# Altium schematic sheet BDK_cam_tay.SchDoc: Bo_dieu_khien_cam_tay
size A4 portrait
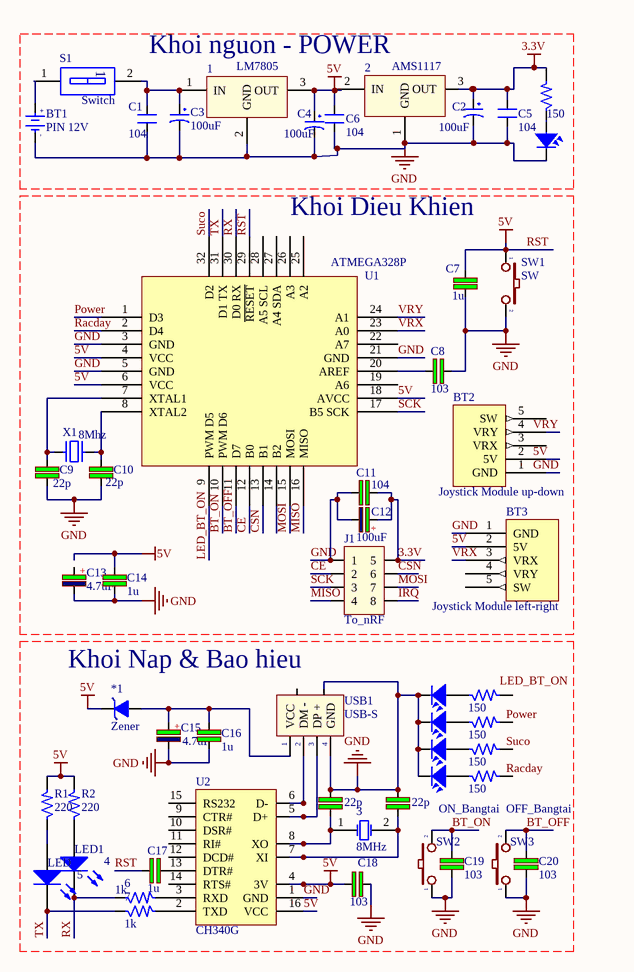
[diagram p0: BDK_cam_tay.SchDoc]

## Parts
(Parts that share a designator on the sheet are numbered #1, #2 ... from top to bottom, then left to right.)
1  LM7805  [QTO-220]
2  AMS1117  [QTO-220]
3  8MHz  [R38]
4  LED1  [3.5X2.8X1.9]
5  LED  [3.5X2.8X1.9]
6  1k  [SM-1206]
7  1k  [SM-1206]
*1  Zener  [D1A]
?#1  150  [SM-RES-1206]
?#2  LED SMD  [SM-LED-0805-Blue]  (value not drawn)
?#3  LED  [LED-3MM-YELLOW]  (value not drawn)
?#4  150  [SM-1206]
?#5  LED  [LED-3MM-YELLOW]  (value not drawn)
?#6  150  [SM-1206]
?#7  LED  [LED-3MM-YELLOW]  (value not drawn)
?#8  150  [SM-1206]
?#9  LED  [LED-3MM-YELLOW]  (value not drawn)
?#10  150  [SM-1206]
?#11  22p  [CN3]
?#12  22p  [CN3]
BT1  PIN 12V  [PIN3V]
BT2  Joystick Module up-down  [Joystick Module - duplicate2]
BT3  Joystick Module left-right  [Joystick Module - duplicate2]
C1  104  [CN2]
C2  100uF  [CP1.5/3.4]
C3  100uF  [CP1.5/3.4]
C4  100uF  [CP1.5/3.4]
C5  104  [CN2]
C6  104  [CN2]
C7  1u  [CN1.5]
C8  103  [C-0805]
C9  22p  [C-0805]
C10  22p  [C-0805]
C11  104  [CN1.5]
C12  100uF  [10uF/10V]
C13  4.7uF  [10uF/10V]
C14  1u  [CN1.5]
C15  4.7uF  [CP4.5/19]
C16  1u  [CN3]
C17  1u  [CN3]
C18  103  [CN3]
C19  103  [CN3]
C20  103  [CN3]
J1  To_nRF  [JP4x2]
R1  220  [SM-1206]
R2  220  [SM-1206]
S1  Switch  [DIP-4]
SW1  SW  [BUTTON 2PIN TRON]
SW2  ON_Bangtai  [SW1-SMD]
SW3  OFF_Bangtai  [SW1-SMD]
U1  ATMEGA328P  [TQFP80P900X900X120-32N]
U2  CH340G  [SO16]
USB1  USB-S  [USB-S1]
X1  8Mhz  [XT2]

## Nets
3.3V: 2.3(OUT) ?#1.2 C2.1 C5.2 C11.1 C12.1 J1.5
5V: 1.3(OUT) 2.2(IN) *1.2(K) BT3.2(5V) C4.1 C6.2 C7.2 C14.2 C17.2 C18.1 R1.2 R2.2 SW1.1 U1.4(VCC) U1.6(VCC) U1.18(AVCC) U1.29(~{RESET}) U2.4(3V) U2.16(VCC)  [also labelled RST]
GND: 1.2(GND) 2.1(GND) ?#2.2 ?#3.2 ?#5.2 ?#7.2 ?#9.2 ?#11.2 ?#12.2 BT1.2(GND) BT3.1(GND) C1.1 C2.2 C3.2 C4.2 C5.1 C6.1 C7.1 C8.1 C9.1 C10.1 C11.2 C12.2 C13.2 C14.1 C15.2 C16.1 C18.2 C19.1 C20.1 J1.1 SW1.2 SW2.1 SW3.1 U1.3(GND) U1.5(GND) U1.21(GND) U2.1(GND) USB1.4(GND) USB1.6
BT_OFF: C20.2 SW3.2 U1.11(D7)
BT_ON: C19.2 SW2.2 U1.10(PWM_D6)
CE: J1.2 U1.12(B0)
CSN: J1.6 U1.13(B1)
IRQ: J1.8
LED_BT_ON: U1.9(PWM_D5)
MISO: J1.4 U1.16(MISO)
MOSI: J1.7 U1.15(MOSI)
Power: U1.1(D3)
Racday: U1.2(D4)
RX: 4.2(K) 6.1 U1.30(D0_RX)
SCK: J1.3 U1.17(B5_SCK)
Suco: U1.32(D2)
TX: 5.2(K) 7.1 U1.31(D1_TX)
VRX: BT3.3(VRX) U1.23(A0)
VRY: U1.24(A1)
Net1_1: 1.1(IN) C1.2 C3.1 S1.2(A2)
Net3_1: 3.1(OSC1) ?#11.1 U2.8(XO)
Net3_2: 3.2(OSC2) ?#12.1 U2.7(XI)
Net4_1: 4.1(A) R2.1
Net5_1: 5.1(A) R1.1
Net6_2: 6.2 U2.3(RXD)
Net7_2: 7.2 U2.2(TXD)
Net*1_1: *1.1(A) C15.1 C16.2 USB1.1(VCC)
Net?#1_1: ?#1.1 ?#2.1
Net?#3_1: ?#3.1 ?#4.1
Net?#5_1: ?#5.1 ?#6.1
Net?#7_1: ?#7.1 ?#8.1
Net?#9_1: ?#9.1 ?#10.1
NetBT1_1: BT1.1(+3V) S1.1(A1)
NetC8_2: C8.2 U1.20(AREF)
NetC9_2: C9.2 U1.7(XTAL1) X1.2
NetC10_2: C10.2 U1.8(XTAL2) X1.1
NetC17_1: C17.1 U2.13(DTR#)
NetU2_5: U2.5(D+) USB1.3(DP_+)
NetU2_6: U2.6(D-) USB1.2(DM_-)

Not connected (* = marked no-connect by the designer): ?#4 2; ?#6 2; ?#8 2; ?#10 2; BT2 1(GND) 2(5V) 3(VRX) 4(VRY) 5(SW); BT3 4(VRY) 5(SW); C13 1; U1 14(B2) 19(A6) 22(A7) 25(A2) 26(A3) 27(A4_SDA) 28(A5_SCL); U2 9(CTR#) 10(DSR#) 11(RI#) 12(DCD#) 14(RTS#) 15(RS232); USB1 5

## Notes on the sheet
- Khoi nguon - POWER
- Khoi Dieu Khien
- Khoi Nap & Bao hieu
- Labels drawn without touching a wire or pin: 5V, GND, LED_BT_ON, Power, Racday, Suco, VRY
- Title
- Size:
- Date:
- A4
- Number:
- Time:
- Revision:
- Sheet
- of
- File:
- (in symbol CP0_1) +
- (in symbol CP9) +
- (in symbol PIN 3V) +; -

## Library data of the parts
1 = LM78xx: On ap +, from + 5 to + 24VDC; Value: LM7805
2 = LM79xx: On ap -, from - 5 to - 24VDC; Value: LM7905
3 = XTAL: Crystal Oscillator; Published: 8-Jun-2000; LatestRevisionDate: 17-Jul-2002; LatestRevisionNote: Re-released for DXP Platform.; PackageReference: R38; Publisher: Altium Limited; PackageDescription: Crystal, Thru-Hole; 2 Leads; Body 3.1 x 8.2 mm (Dia.xH)
4 5 = LED3: Typical BLUE SiC LED; Published: 8-Jun-2000; LatestRevisionDate: 17-Dec-2003; LatestRevisionNote: PCB Footprint replaced.; DatasheetVersion: 16-Apr-2002; PackageVersion: 16-Apr-2002; PackageReference: 3.5X2.8X1.9; Publisher: Altium Limited; PackageDescription: SM LED; 2 C-Bend Leads; Body 3.5 x 2.8 x 1.9 mm, inc leads (LxWxH typ)
6 7 ?#1 ?#4 ?#6 ?#8 ?#10 R1 R2 = R: Resistor 1/4W; Value: R1/4W - 1K
*1 = Zener: DIOT ZENER
?#2 = LED-SMD-0805
?#3 ?#5 ?#7 ?#9 = LED: LED Single colour Green and Red; Value: LED 3 ly Single Colour
?#11 ?#12 C16-C20 = CN3: Cap np W0.3; Value: 0,047uF; Copyright: VanDungEvn
BT1 = PIN 3V: Battery 3VDC; Value: PIN 3V
BT2 BT3 = Joystick Module: WS: 0, PULL UP 4K7; WEB: TECHMT.VN
C1 C5 C6 = CN2: Cap np 104 => 105pF; Value: 0.1uF
C2-C4 = CP3: Cap 100uF/35V - 470uF/16V; Value: 100uF/35V/50V; Description 1: 1000uF/6,3V - 470uF/16V - 330uF - 25V; Description 2: 220uF/35V - 100uF/50V - 63V - 4,7uF/200V; Description 3: 22uF => 33uF100V - 3,3uF => 4,7uF/250V; Description 4: 2,2uF =>3,3uF/350 - 2,2uF/400V - 1uF/450V
C7 C11 C14 = CN1.5: Cap np 682pF => 104pF; Value: 0.01uF
C8 = C: Cap SMD; Value: 103
C9 C10 = C: Cap SMD; Value: 103
C12 C13 = CP0_1: Cap P  0,1uF < 22uF , 16 - 50V; Value: 10uF/50V; Description 1: 10 => 220uF/6,3V/10V - 10uF => 100uF/16V; Description 2: 0,1uF => 33uF/50V - 10uF => 22uF/63V; Description 3: 0,47uF => 10uF/100V
C15 = CP9: Cap 10000uF/63V; Value: 220uF/450V
J1 = JP4x2: Connector 4x2; Value: Connector 4x2
S1 = SW DIP-1: DIP Switch, 2 Position, SPST; Published: 24-Mar-1999; LatestRevisionDate: 17-Jul-2002; LatestRevisionNote: Re-released for DXP Platform.; PackageReference: DIP-4; Publisher: Altium Limited
SW1-SW3 = SW2: Switch button 2 pin; Value: SW chip 2 pin
U1 = ATMEGA328P-AU: Microchip Technology ATMEGA328P-AN, 8bit AVR Microcontroller, 20MHz, 32 kB Flash, 32-Pin TQFP
U2 = CH340G: High and Low Side Driver; Note: Pins 4, 8 and 14 are not connected; Published: 8-Jun-2000; LatestRevisionDate: 04-Mar-2005; LatestRevisionNote: Stylized 3D Model Added.; DatasheetVersion: PD60147J; PackageReference: PDIP14; Publisher: Altium Limited; PackageDescription: DIP; 14 Leads; Row Spacing 7.62 mm; Pitch 2.54 mm; ComponentLink1Description: Manufacturer Link; ComponentLink1URL: http://www.irf.com/; ComponentLink2Description: Datasheet; ComponentLink2URL: http://www.irf.com/product-info/datasheets/data/ir2110.pdf
USB1 = USB_S: USB connector; Value: USB
X1 = XT2: Crystal For all Crystal 2pin.; Value: 4Mhz